# Altium schematic sheet P1.schdoc
size 297 x 209 mm; Symbol: Drawing-Symbol_A4; Company: 嘉立创EDA; Version: V1.0; Page Size: A4; @Project Name: Boost电路; @Update Date: 2026-08-18; @Create Date: 2026-08-18; Device: Drawing-Symbol_A4; @Board Name: Board1; @Page Name: P1; @Create Time: 22:03:05; @Page Count: 1; @Page No: 1; @Schematic Name: Schematic1; @Update Time: 22:03:05; @Assembly Variant: Basic; Border: 1; Title Block Position: 3; Size: A4; Width: 1170; Height: 825; Region Start: 1; X Region Count: 6; Y Region Count: 4; Blade Width: 10
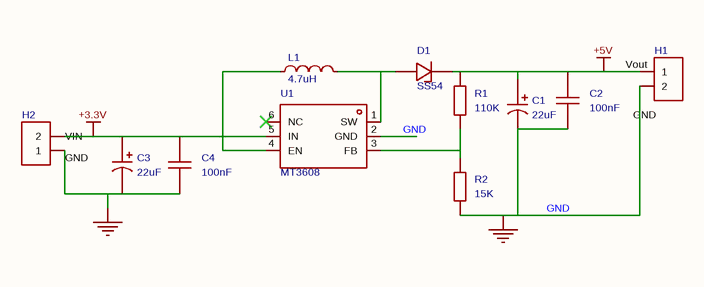
[diagram p0: P1.schdoc]

## Parts
C1  22uF  [CAP-TH_BD10.0-P5.00-D0.6-FD-H20]
C2  100nF  [C1206]
C3  22uF  [CAP-TH_BD10.0-P5.00-D0.6-FD-H20]
C4  100nF  [C1206]
D1  SS54  [SMA_L4.3-W2.6-LS5.0-FD]
H1  (no value)  [HDR-TH_2P-P2.54-V-F]
H2  (no value)  [HDR-TH_2P-P2.54-V-F]
L1  4.7uH  [IND-SMD_L5.4-W5.2_FXL0530]
R1  110K  [R1206]
R2  15K  [R1206]
U1  MT3608  [SOT-23-6_L2.9-W1.6-P0.95-LS2.8-BL]

## Nets
+3.3V: C3.1 C4.2 H2.2 L1.1 U1.4(EN) U1.5(IN)
+5V: C1.1 C2.2 D1.2(K) H1.1 R1.2
GND: C1.2 C2.1 C3.2 C4.1 H1.2 H2.1 R2.1 U1.2(GND)
NetD1_1: D1.1(A) L1.2 U1.1(SW)
NetR1_1: R1.1 R2.2 U1.3(FB)

Not connected (* = marked no-connect by the designer): U1 6(NC)*

## Notes on the sheet
- (near H1) Vout
- (near H2) VIN
- (near H1) GND
- (near H2) GND
- 创建日期
- 2026-08-18
- 原理图
- 板子
- Schematic1
- Board1
- 更新日期
- 图页
- P1
- 绘制
- 审阅
- Boost电路
- 版本
- V1.0
- 尺寸
- A4
- 页    1    共    1
- 嘉立创EDA

## Library data of the parts
C1 C3 = ERG450V22M10X20: 容值:22uF;精度:±20%;额定电压:450V;纹波电流:115mA@100kHz;等效串联电阻(ESR):7.63Ω@100kHz;; Manufacturer: JIERR(捷而瑞); AddInBom: yes; ModelId: ac0f3fd08c8a42488d60b9dec8fc083e0819f05c4eef4c71ace90d822a990e87; ModelTransform: 392.903,394.09216,0,0,0,0,0,0,-196.85; Tolerance: ±20%; Voltage Rating: 450V; Pin Spacing: 5mm; Lifetime: 3000hrs@105℃; Symbol: ERG450V22M10X20; Device: ERG450V22M10X20; LCSC Part Name: 22uF ±20% 450V; SupplierPart: C51904482; ManufacturerPart: ERG450V22M10X20; Supplier Footprint: 插件,D10xL20mm; JLCPCB Part Class: Extended Part; Datasheet: https://item.szlcsc.com/datasheet/ERG450V22M10X20/54596851.html; Supplier: LCSC; ConvertToPcb: yes; FootprintName: CAP-TH_BD10.0-P5.00-D0.6-FD-H20; ModelName: CAP-TH_BD10.0-P5.00-D0.6-FD-H20; Value: 22uF; Ripple Current: 115mA@100kHz; Equivalent Series Resistance(ESR): 7.63Ω@100kHz; Diameter: 10mm; Height - Seated (Max): 20mm; Operating Temperature: -25℃~+105℃
C2 C4 = CAP_1206: Symbol: Capacitance; ConvertToPcb: yes; ModelId: e4be705b945545a48e666415e3682bd80819f05c4eef4c71ace90d822a990e87; ModelName: C1206_L3.2-W1.6-H1.3; ModelTransform: 125.984,62.992,0,0,0,0,0,0,0; Device: CAP_1206; AddInBom: yes; Supplier Footprint: 1206; FootprintName: C1206; Value: 100nF
D1 = SS54_C7420369: 二极管配置:独立式;正向压降(Vf):550mV@5A;直流反向耐压(Vr):40V;整流电流:5A;; Manufacturer: R+O(宏嘉诚); AddInBom: yes; ModelId: 7e24bebe6cd74171ae8c9de6fc5b78aa0819f05c4eef4c71ace90d822a990e87; ModelTransform: 198.4248,103.5431,0,180,0,0,-0.001,0,0; Diode Configuration: 独立式; Voltage - DC Reverse(Vr): 40V; Current - Rectified: 5A; Reverse Leakage Current (Ir): 50uA@40V; Operating Junction Temperature Range: -55℃~+125℃; Non-Repetitive Peak Forward Surge Current: 120A; Symbol: SS54_C7420369; Device: SS54_C7420369; LCSC Part Name: 电压:40V 电流:5A; SupplierPart: C7420369; ManufacturerPart: SS54; Supplier Footprint: SMA(DO-214AC); JLCPCB Part Class: Extended Part; Datasheet: https://item.szlcsc.com/datasheet/SS54/8397191.html; Supplier: LCSC; ConvertToPcb: yes; FootprintName: SMA_L4.3-W2.6-LS5.0-FD; ModelName: SMA_L4.3-W2.6-LS5.0-FD; Voltage - Forward(Vf@If): 550mV@5A
H1 H2 = HDR-F_2.54_1x2P: Symbol: Header-Female-2.54_1x2; ConvertToPcb: yes; ModelId: a9450ef445564560a104363b9aacde4e0819f05c4eef4c71ace90d822a990e87; ModelName: HDR-TH_2P-P2.54-F-LI-1X2P; ModelTransform: 215.7476,98.425,0,0,0,0,0,0,-129.921; Device: HDR-F_2.54_1x2P; AddInBom: yes; SupplierPart: C49661; Supplier Footprint: 插件; FootprintName: HDR-TH_2P-P2.54-V-F
L1 = FXL0530-4R7-M: 电感值:4.7uH;精度:±20%;额定电流:4.5A;饱和电流(Isat):5A;类型:一体成型电感;; Manufacturer: cjiang(长江微电); AddInBom: yes; ModelId: e41ad6dce8434108a9c5d36a52ebad3b0819f05c4eef4c71ace90d822a990e87; ModelName: IND-SMD_L5.4-W5.2-H2.8_FXL0530; ModelTransform: 212.598,204.724,0,0,0,0,0,0,0; Tolerance: ±20%; Current Rating: 4.5A; Current - Saturation(Isat): 5A; DC Resistance(DCR): 60mΩ; Type: 一体成型电感; Symbol: FXL0530-4R7-M; Device: FXL0530-4R7-M; LCSC Part Name: 4.7uH ±20% 5A; SupplierPart: C177246; ManufacturerPart: FXL0530-4R7-M; Supplier Footprint: SMD,5.4x5.2mm; JLCPCB Part Class: Extended Part; Datasheet: https://item.szlcsc.com/datasheet/FXL0530-4R7-M/188638.html; Supplier: LCSC; ConvertToPcb: yes; FootprintName: IND-SMD_L5.4-W5.2_FXL0530; Value: 4.7uH
R1 R2 = Res_1206: Symbol: 电阻; AddInBom: yes; ModelId: 89a1f13db2384da588040e0b3c55bf660819f05c4eef4c71ace90d822a990e87; ModelName: R1206_L3.2-W1.6-H0.6; ModelTransform: 125.984,62.992,0,0,0,0,0,0,0; Device: Res_1206; Supplier Footprint: 1206; ConvertToPcb: yes; FootprintName: R1206
  R1: Value: 110K
  R2: Value: 15K
U1 = MT3608: 功能类型:升压型;工作电压:2V~24V;输出电压:600mV~28V;输出电流:2A;输出类型:可调;; Manufacturer: 西安航天民芯; AddInBom: yes; ModelId: 18da8f6c14a34920b3e136b5c401a1190819f05c4eef4c71ace90d822a990e87; ModelName: SOT-23-6_L2.9-W1.6-H1.5-LS2.8-P0.95; ModelTransform: 110.236,113.364,0,90,0,0,0.0005,0.0005,0; Function: 升压型; Voltage - Supply: 2V~24V; Output Current: 2A; Frequency - Switching: 1.2MHz; Synchronous Rectifier: 否; Number of Outputs: 1; Topology: 升压式; Quiescent Current: 100uA；1.6mA; Switch tube (built-in/external): 内置; Output Type: 可调; Symbol: MT3608; Device: MT3608; LCSC Part Name: 老版本 升压型 2A 2V~24V; SupplierPart: C84817; ManufacturerPart: MT3608; Supplier Footprint: SOT-23-6; JLCPCB Part Class: Extended Part; Datasheet: https://item.szlcsc.com/datasheet/MT3608/85988.html; Supplier: LCSC; ConvertToPcb: yes; FootprintName: SOT-23-6_L2.9-W1.6-P0.95-LS2.8-BL; Output Voltage: 600mV~28V; Operating Temperature: -40℃~+85℃; Features: 轻载高效模式；过流保护